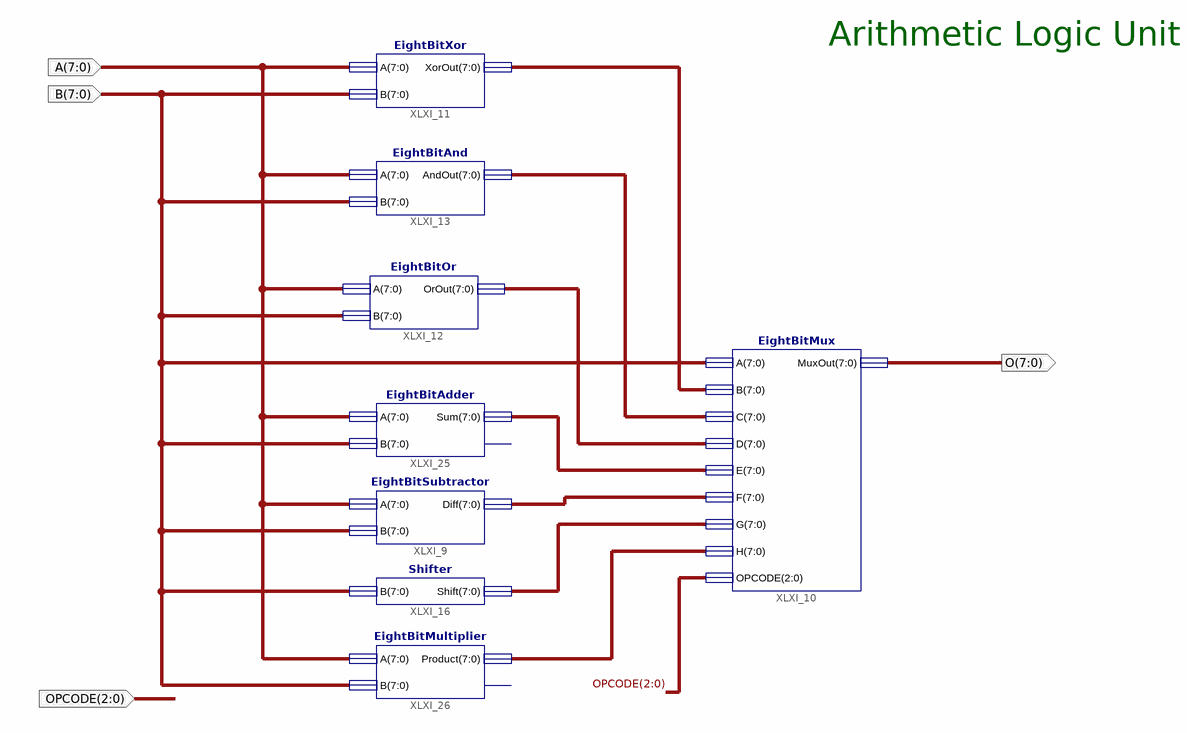
[diagram p0: schematic sheet 1]
// Xilinx ISE schematic ALU.sch (spartan6) as structural Verilog: 8 symbols, 4 ports
module ALU (
  input  [2:0] OPCODE,
  input  [7:0] A,
  input  [7:0] B,
  output [7:0] O
);

  wire [7:0] XLXN_46, XLXN_48, XLXN_61, XLXN_62, XLXN_63, XLXN_65, XLXN_70;

  EightBitSubtractor XLXI_9 (.A(A), .B(B), .Diff(XLXN_46));
  EightBitMux XLXI_10 (
    .A(B), .B(XLXN_48), .MuxOut(O), .C(XLXN_61), .D(XLXN_62), .E(XLXN_63), .F(XLXN_46), .G(XLXN_65),
    .H(XLXN_70), .OPCODE(OPCODE));
  EightBitXor XLXI_11 (.A(A), .B(B), .XorOut(XLXN_48));
  EightBitOr XLXI_12 (.A(A), .B(B), .OrOut(XLXN_62));
  EightBitAnd XLXI_13 (.A(A), .B(B), .AndOut(XLXN_61));
  Shifter XLXI_16 (.B(B), .Shift(XLXN_65));
  EightBitAdder XLXI_25 (.A(A), .B(B), .Sum(XLXN_63));  // open: Cout
  EightBitMultiplier XLXI_26 (.A(A), .B(B), .Product(XLXN_70));  // open: Cout

  // Notes on the sheet:
  //   Arithmetic Logic Unit
endmodule
